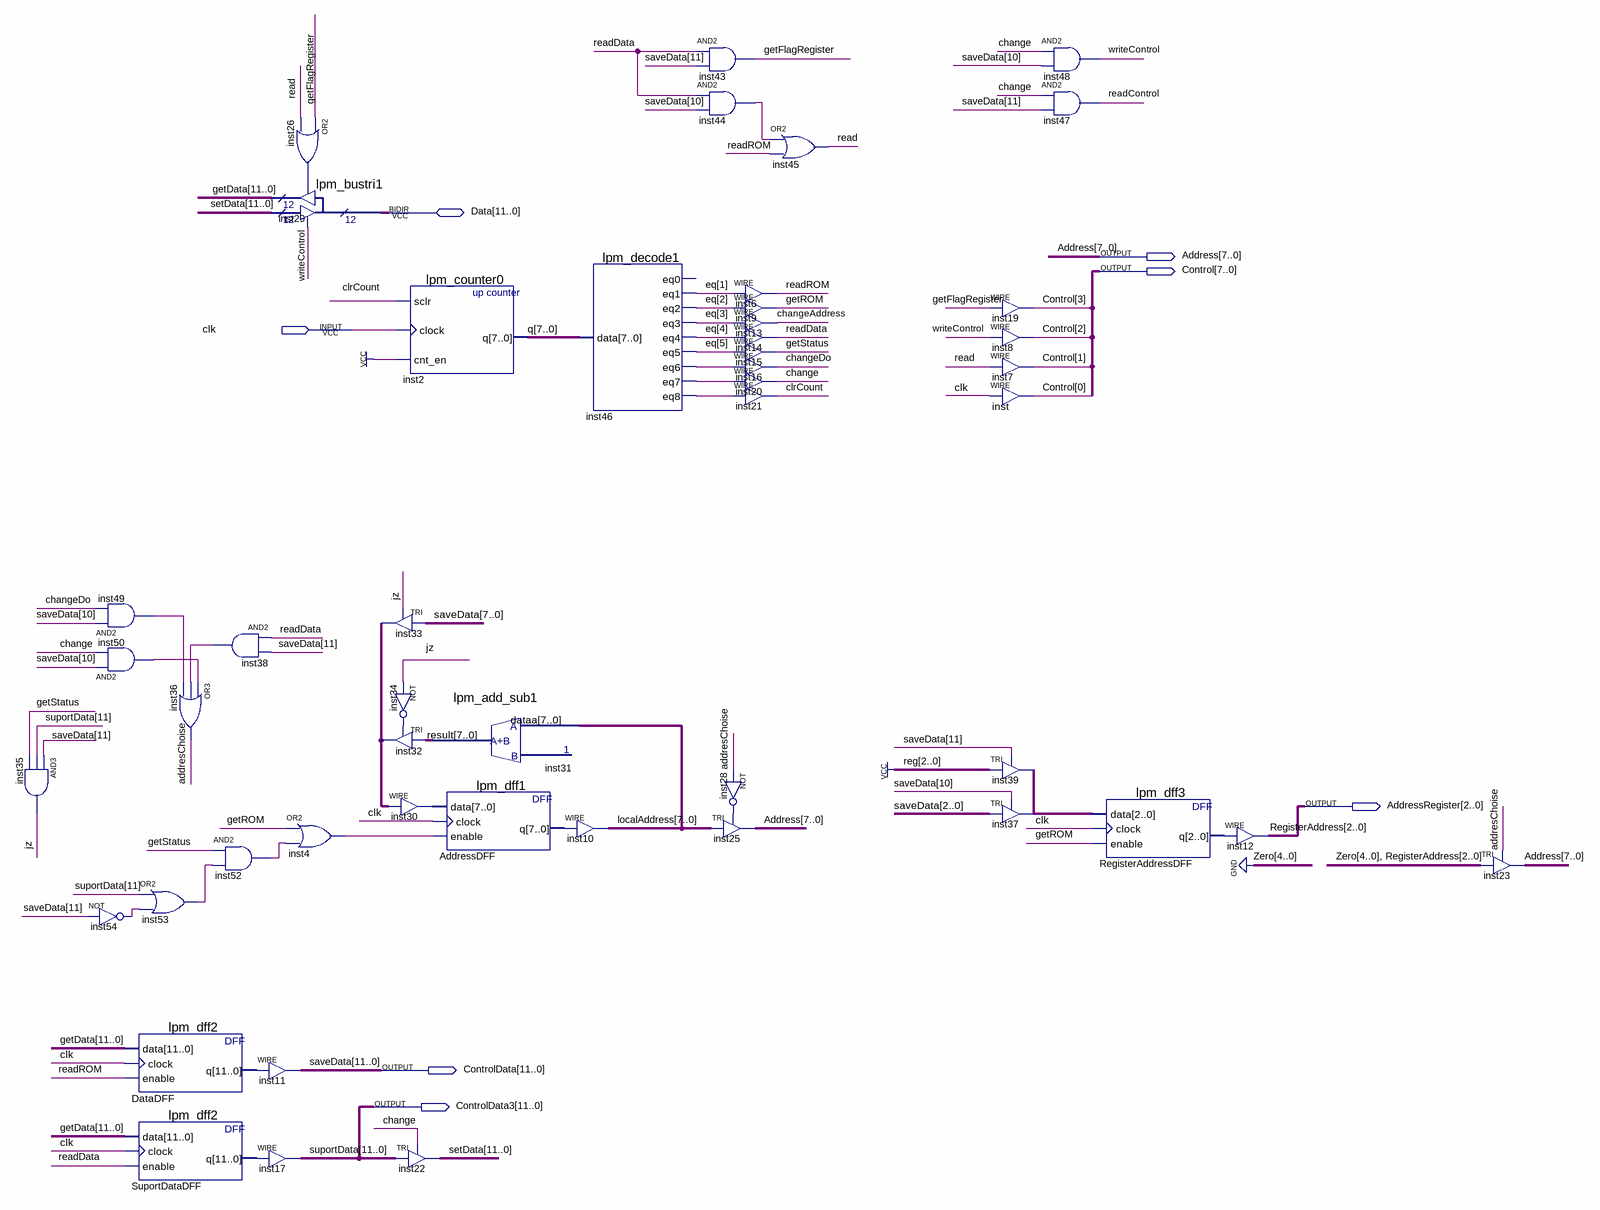
[diagram p0: schematic sheet]
// Quartus schematic cu.bdf as structural Verilog: 49 symbols, 7 pins
module cu (
  input  clk,
  inout  [11:0] Data,
  output [7:0] Address,
  output [7:0] Control,
  output [2:0] AddressRegister,
  output [11:0] ControlData,
  output [11:0] ControlData3
);

  wire addresChoise, change, changeAddress, changeDo, clrCount, getFlagRegister, getROM, getStatus,
       inst4_out, inst26_out, inst28_out, inst34_out, inst38_out, inst44_out, inst46_eq6, inst46_eq7,
       inst46_eq8, inst49_out, inst50_out, inst52_out, inst53_out, inst54_out, jz, read, readControl,
       readData, readROM, writeControl;
  wire [2:0] inst39_out, RegisterAddressDFF_q;
  wire [5:1] eq;
  wire [7:0] AddressDFF_q, inst30_out, inst31_result, inst33_out, localAddress, q;
  wire [11:0] DataDFF_q, getData, setData, SuportDataDFF_q;

  and inst35 (jz, ControlData[11], ControlData3[11], getStatus);
  and inst49 (inst49_out, ControlData[10], changeDo);
  and inst50 (inst50_out, ControlData[10], change);
  not inst54 (inst54_out, ControlData[11]);
  or inst53 (inst53_out, ControlData3[11], inst54_out);
  lpm_dff2 DataDFF (.data(getData), .clock(clk), .enable(readROM), .q(DataDFF_q));
  lpm_dff2 SuportDataDFF (.data(getData), .clock(clk), .enable(readData), .q(SuportDataDFF_q));
  and inst38 (inst38_out, readData, ControlData[11]);
  or inst36 (addresChoise, inst50_out, inst38_out, inst49_out);
  and inst52 (inst52_out, getStatus, inst53_out);
  lpm_bustri1 inst29 (.enabledt(writeControl), .data(setData), .enabletr(inst26_out), .result(getData), .tridata(Data));
  assign ControlData = DataDFF_q;  // WIRE inst11
  assign ControlData3 = SuportDataDFF_q;  // WIRE inst17
  or inst26 (inst26_out, getFlagRegister, read);
  or inst4 (inst4_out, getROM, inst52_out);
  lpm_counter0 inst2 (.sclr(clrCount), .clock(clk), .cnt_en(1'b1), .q(q));
  TRI inst33[7:0] (.IN(ControlData[7:0]), .OE(jz), .OUT(inst33_out));
  not inst34 (inst34_out, jz);
  TRI inst32[7:0] (.IN(inst31_result), .OE(inst34_out), .OUT(inst33_out));
  assign inst30_out = inst33_out;  // WIRE inst30
  TRI inst22[11:0] (.IN(ControlData3), .OE(change), .OUT(setData));
  lpm_add_sub1 inst31 (.dataa(localAddress), .result(inst31_result));
  lpm_dff1 AddressDFF (.data(inst30_out), .clock(clk), .enable(inst4_out), .q(AddressDFF_q));
  assign localAddress = AddressDFF_q;  // WIRE inst10
  lpm_decode1 inst46 (
    .data(q), .eq1(eq[1]), .eq2(eq[2]), .eq3(eq[3]), .eq4(eq[4]), .eq5(eq[5]), .eq6(inst46_eq6),
    .eq7(inst46_eq7), .eq8(inst46_eq8));  // open: eq0
  and inst43 (getFlagRegister, readData, ControlData[11]);
  and inst44 (inst44_out, readData, ControlData[10]);
  assign readROM = eq[1];  // WIRE inst6
  assign getROM = eq[2];  // WIRE inst9
  assign changeAddress = eq[3];  // WIRE inst13
  assign readData = eq[4];  // WIRE inst14
  assign getStatus = eq[5];  // WIRE inst15
  assign changeDo = inst46_eq6;  // WIRE inst16
  assign change = inst46_eq7;  // WIRE inst20
  assign clrCount = inst46_eq8;  // WIRE inst21
  not inst28 (inst28_out, addresChoise);
  TRI inst25[7:0] (.IN(localAddress), .OE(inst28_out), .OUT(Address));
  or inst45 (read, inst44_out, readROM);
  and inst48 (writeControl, change, ControlData[10]);
  and inst47 (readControl, change, ControlData[11]);
  assign Control[3] = getFlagRegister;  // WIRE inst19
  assign Control[2] = writeControl;  // WIRE inst8
  assign Control[1] = read;  // WIRE inst7
  assign Control[0] = clk;  // WIRE inst
  TRI inst39[2:0] (.IN(3'b111), .OE(ControlData[11]), .OUT(inst39_out));
  TRI inst37[2:0] (.IN(ControlData[2:0]), .OE(ControlData[10]), .OUT(inst39_out));
  lpm_dff3 RegisterAddressDFF (.data(inst39_out), .clock(clk), .enable(getROM), .q(RegisterAddressDFF_q));
  assign AddressRegister = RegisterAddressDFF_q;  // WIRE inst12
  TRI inst23[7:0] (.IN({{5{1'b0}}, AddressRegister}), .OE(addresChoise), .OUT(Address));

  // Other names for the same wires on the sheet: RegisterAddress[2:0] = AddressRegister; saveData[11:0] = ControlData;
  //   suportData[11:0] = ControlData3
endmodule
